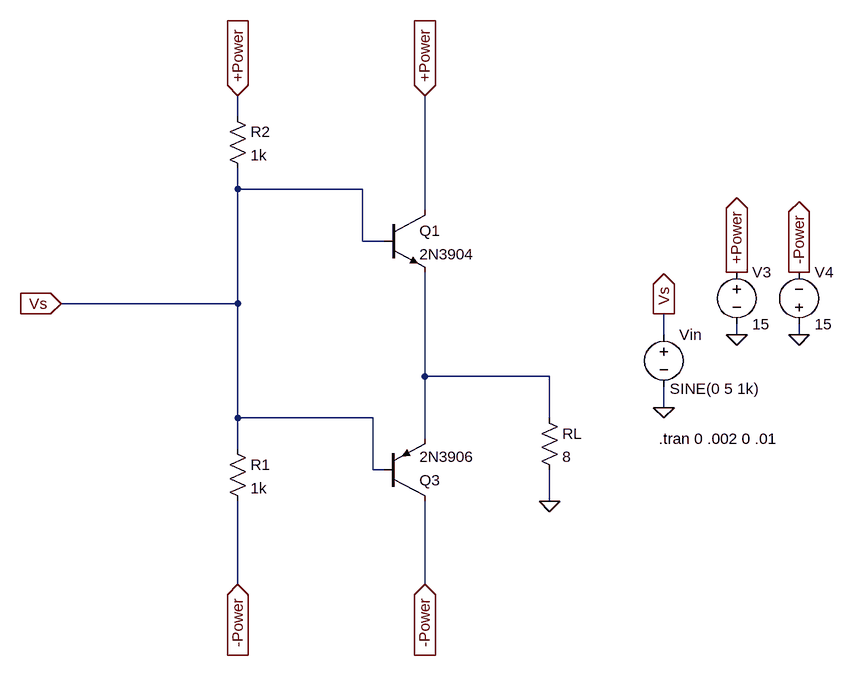
[diagram p0: schematic Power Amp - Con error.asc]
Power Amp - Con error.asc, the LTspice schematic file:
Version 4.1
SHEET 1 7092 1032
WIRE 496 -288 496 -320
WIRE 496 -176 496 -208
WIRE 688 -176 496 -176
WIRE 784 -144 784 -320
WIRE 688 -96 688 -176
WIRE 720 -96 688 -96
WIRE 496 0 496 -176
WIRE 496 0 224 0
WIRE 1152 48 1152 16
WIRE 1264 48 1264 32
WIRE 1360 48 1360 32
WIRE 784 112 784 -48
WIRE 976 112 784 112
WIRE 1152 160 1152 128
WIRE 496 176 496 0
WIRE 704 176 496 176
WIRE 976 176 976 112
WIRE 784 208 784 112
WIRE 496 224 496 176
WIRE 704 256 704 176
WIRE 720 256 704 256
WIRE 976 304 976 256
WIRE 496 432 496 304
WIRE 784 432 784 304
FLAG 1360 -48 -Power
IOPIN 1360 -48 Out
FLAG 1264 -48 +Power
IOPIN 1264 -48 Out
FLAG 1264 48 0
FLAG 1360 48 0
FLAG 1152 160 0
FLAG 1152 16 Vs
IOPIN 1152 16 Out
FLAG 496 -320 +Power
IOPIN 496 -320 In
FLAG 784 -320 +Power
IOPIN 784 -320 In
FLAG 784 432 -Power
IOPIN 784 432 In
FLAG 976 304 0
FLAG 224 0 Vs
IOPIN 224 0 In
FLAG 496 432 -Power
IOPIN 496 432 In
SYMBOL voltage 1264 -64 R0
WINDOW 123 0 0 Left 0
WINDOW 39 0 0 Left 0
SYMATTR InstName V3
SYMATTR Value 15
SYMBOL voltage 1360 48 M180
WINDOW 0 24 96 Left 2
WINDOW 3 24 16 Left 2
WINDOW 123 0 0 Left 0
WINDOW 39 0 0 Left 0
SYMATTR InstName V4
SYMATTR Value 15
SYMBOL voltage 1152 32 R0
WINDOW 123 0 0 Left 0
WINDOW 39 0 0 Left 0
WINDOW 3 9 99 Left 2
SYMATTR Value SINE(0 5 1k)
SYMATTR InstName Vin
SYMBOL npn 720 -144 R0
SYMATTR InstName Q1
SYMATTR Value 2N3904
SYMBOL res 480 -304 R0
SYMATTR InstName R2
SYMATTR Value 1k
SYMBOL res 960 160 R0
SYMATTR InstName RL
SYMATTR Value 8
SYMBOL res 480 208 R0
SYMATTR InstName R1
SYMATTR Value 1k
SYMBOL pnp 720 304 M180
SYMATTR InstName Q3
SYMATTR Value 2N3906
TEXT 1144 208 Left 2 !.tran 0 .002 0 .01

The netlist it stands for:
* Power Amp - Con error.asc
V3 +Power 0 15
V4 0 -Power 15
Vin Vs 0 SINE(0 5 1k)
Q1 +Power Vs N001 0 2N3904
R2 +Power Vs 1k
RL N001 0 8
R1 Vs -Power 1k
Q3 -Power Vs N001 0 2N3906
.model NPN NPN
.model PNP PNP
.lib standard.bjt
.tran 0 .002 0 .01
.backanno
.end